# Altium schematic sheet Camera.SchDoc: 8 Bit Camera
size A4; SheetSize: A4
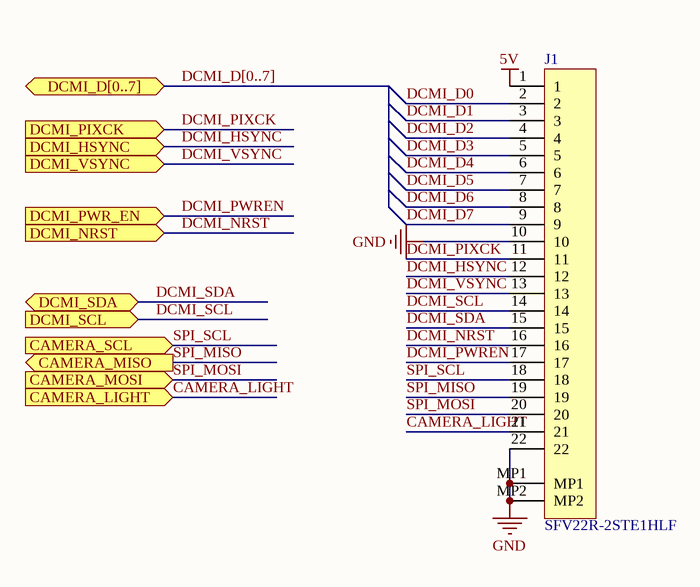
[diagram p0: Camera.SchDoc]

## Parts
J1  SFV22R-2STE1HLF  [fpc-22]

## Ports
CAMERA_LIGHT (in), CAMERA_MISO (out), CAMERA_MOSI (in), CAMERA_SCL (in), DCMI_D[0..7] (bidir), DCMI_HSYNC (in), DCMI_NRST (in), DCMI_PIXCK (in), DCMI_PWR_EN (in), DCMI_SCL (in), DCMI_SDA (bidir), DCMI_VSYNC (in)

## Nets
5V: J1.1
GND: J1.10 J1.22 J1.MP1 J1.MP2
CAMERA_LIGHT: J1.21 ; port CAMERA_LIGHT
DCMI_D0: J1.2
DCMI_D1: J1.3
DCMI_D2: J1.4
DCMI_D3: J1.5
DCMI_D4: J1.6
DCMI_D5: J1.7
DCMI_D6: J1.8
DCMI_D7: J1.9
DCMI_HSYNC: J1.12 ; port DCMI_HSYNC
DCMI_NRST: J1.16 ; port DCMI_NRST
DCMI_PIXCK: J1.11 ; port DCMI_PIXCK
DCMI_PWREN: J1.17 ; port DCMI_PWR_EN
DCMI_SCL: J1.14 ; port DCMI_SCL
DCMI_SDA: J1.15 ; port DCMI_SDA
DCMI_VSYNC: J1.13 ; port DCMI_VSYNC
SPI_MISO: J1.19 ; port CAMERA_MISO
SPI_MOSI: J1.20 ; port CAMERA_MOSI
SPI_SCL: J1.18 ; port CAMERA_SCL

## Buses and harness runs
bus DCMI_D[0..7] = port DCMI_D[0..7]

## Notes on the sheet
- Title:
- Size:
- Project:
- Revision:
- Sheet
- of
- Date:
- YıLDıZ IoT
- Elperek Mahallesi
- Saray Sokak, No:12
- SAKARYA / TURKEY
- File:

## Library data of the parts
J1 = FPC-22: Connector; Manufacturer: Amphenol FCI; Actuator Material: Glass,Polyphenylene; Current Rating: 500mA; Voltage Rating: 50V; Contact Resistance: 30mR; Number of Positions: 22; Contact Location: Top; Insulation Resistance: 100MR; Wire/Cable Type: Straight; Pitch: 0.5mm; Supplier 1: Digi-Key; Supplier Part Number 1: 609-4319-1-ND; Manufacturer Part Number: SFV22R-2STE1HLF; Stock 1: 2152; Pricing 1: 1 = 0,79000, 10 = 0,74300, 25 = 0,66840, 50 = 0,59420, 100 = 0,56950, 250 = 0,52000, 500 = 0,49522, 1000 = 0,40856 (USD); RoHS: Yes; Mount: Surface Mount; Housing Color: Black; Contact Material: Bronze; Contact Plating: Tin; Housing Material: Polymer; Min Operating Temperature: -55°C; Max Operating Temperature: 105°C; Number of Rows: 1; Package Quantity: 3000; Packaging: Tape and Reel; Max Current Rating: 500mA; Termination: Solder; Number of Contacts: 22; Max Voltage Rating (AC): 50V; Orientation: Right Angle; Length: 16.5mm; Depth: 4.9mm; Radiation Hardening: No; Flammability Rating: UL94 V-0; ComponentLink1URL: https://datasheet.ciiva.com/670/10112793-670003.pdf?src-supplier=Digi-Key; ComponentLink1Description: https://datasheet.ciiva.com/670/10112793-670003.pdf?src-supplier=Digi-Key; ComponentLink2URL: https://datasheet.ciiva.com/670/10112793-670004.pdf?src-supplier=Digi-Key; ComponentLink2Description: https://datasheet.ciiva.com/670/10112793-670004.pdf?src-supplier=Digi-Key; ComponentLink3URL: https://datasheet.ciiva.com/13704/10112793-13704492.pdf?src-supplier=Mouser; ComponentLink3Description: https://datasheet.ciiva.com/13704/10112793-13704492.pdf?src-supplier=Mouser; ComponentLink4URL: https://datasheet.ciiva.com/670/10112793-670005.pdf?src-supplier=Digi-Key; ComponentLink4Description: https://datasheet.ciiva.com/670/10112793-670005.pdf?src-supplier=Digi-Key; ComponentLink5URL: https://datasheet.ciiva.com/10368/10112793-10368190.pdf?src-supplier=Avnet; ComponentLink5Description: https://datasheet.ciiva.com/10368/10112793-10368190.pdf?src-supplier=Avnet